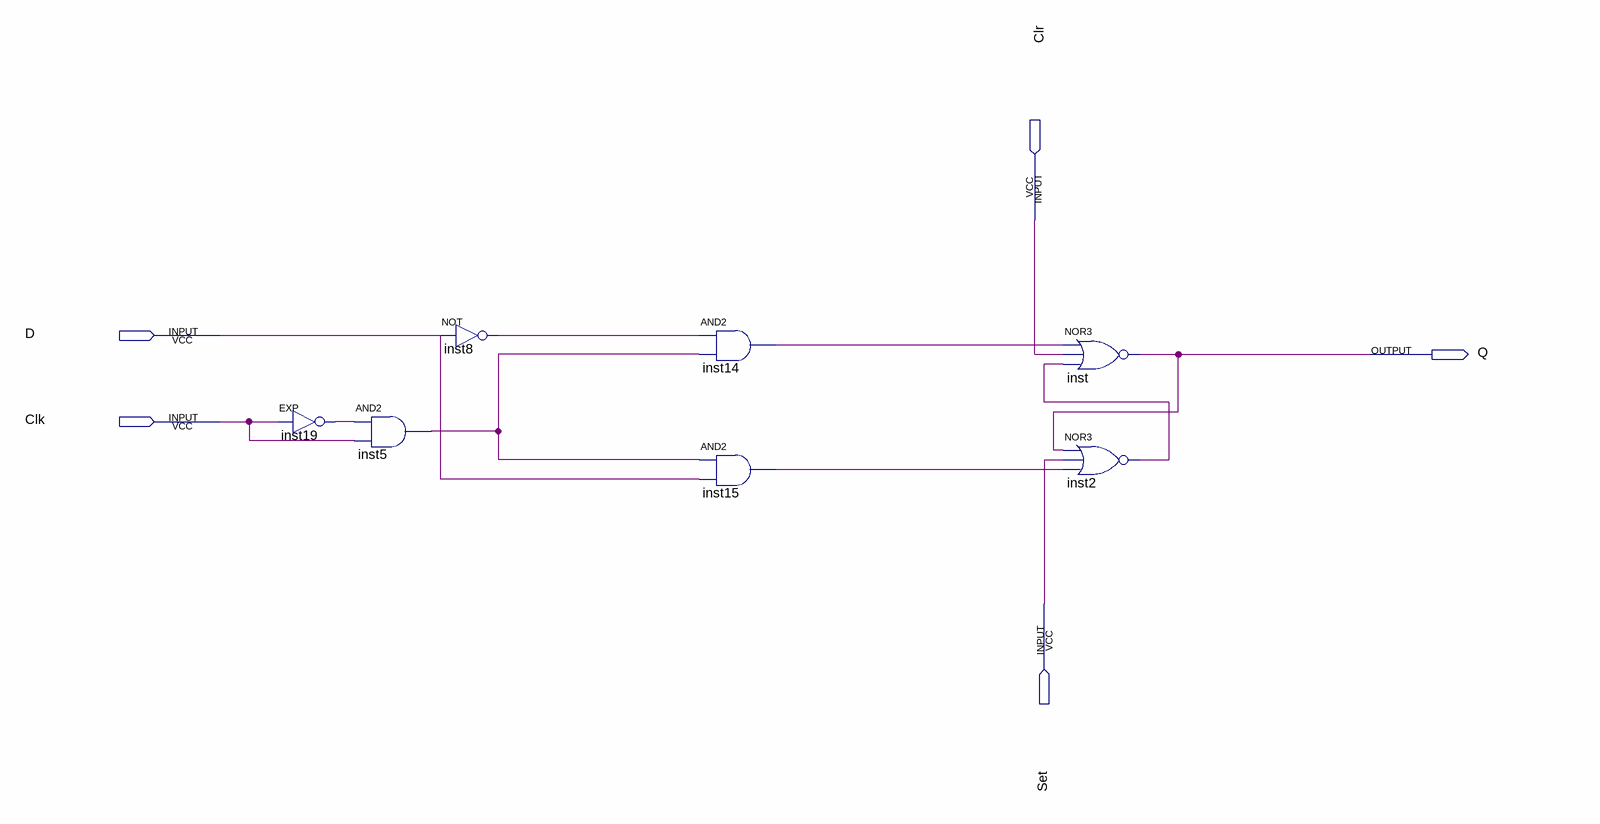
[diagram p0: schematic sheet]
// Quartus schematic FlipFLop-DRS.bdf as structural Verilog: 7 symbols, 5 pins
module \FlipFLop-DRS  (
  input  Clr,
  input  D,
  input  Clk,
  input  Set,
  output Q
);

  wire inst2_out, inst5_out, inst8_out, inst14_out, inst15_out, inst19_out;

  EXP inst19 (.IN(Clk), .OUT(inst19_out));
  and inst5 (inst5_out, inst19_out, Clk);
  not inst8 (inst8_out, D);
  and inst14 (inst14_out, inst8_out, inst5_out);
  and inst15 (inst15_out, inst5_out, D);
  nor inst (Q, inst14_out, Clr, inst2_out);
  nor inst2 (inst2_out, Q, Set, inst15_out);
endmodule
